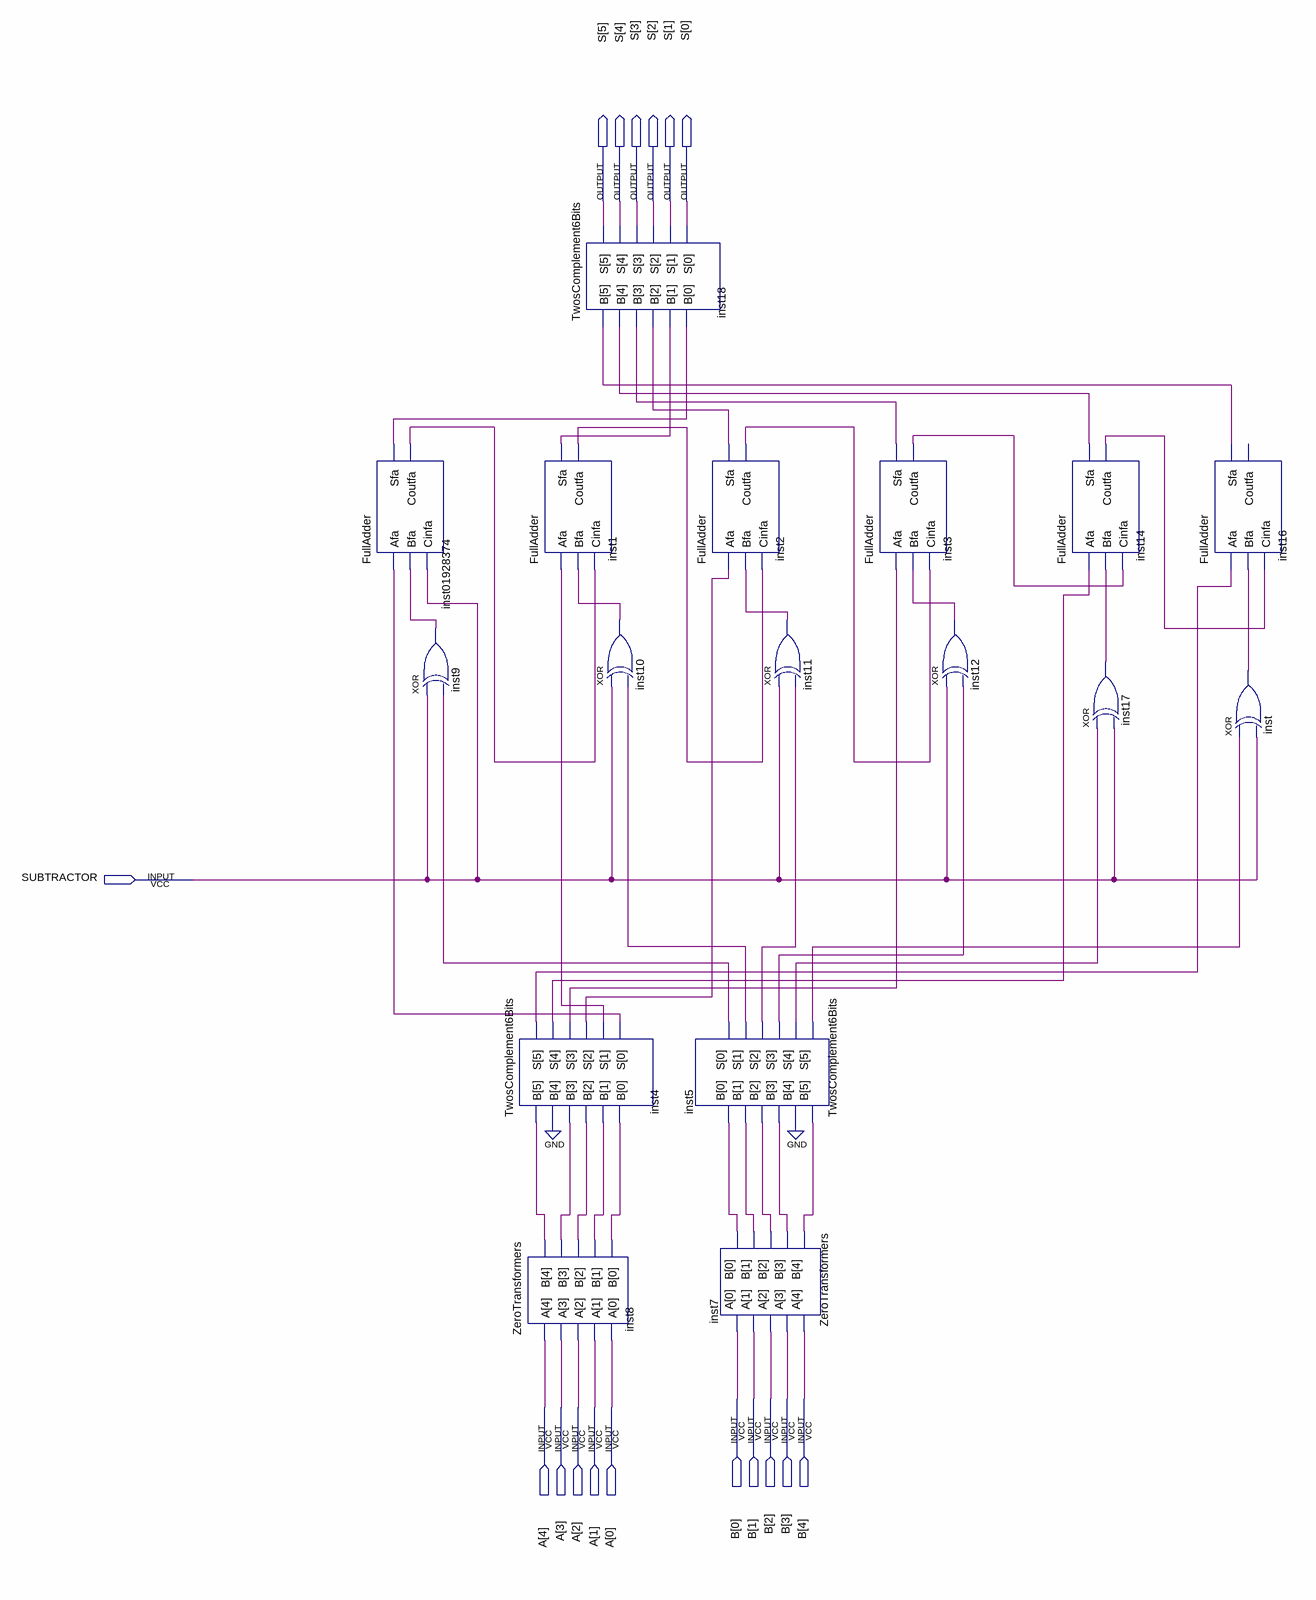
[diagram p0: schematic sheet]
// Quartus schematic SummerSubtractor.bdf as structural Verilog: 17 symbols, 17 pins
module SummerSubtractor (
  input  SUBTRACTOR,
  input  [4:0] B,
  input  [4:0] A,
  output [5:0] S
);

  wire inst1_coutfa, inst1_sfa, inst2_coutfa, inst2_sfa, inst3_coutfa, inst3_sfa, inst4_s, inst4_s_2,
       inst4_s_3, inst4_s_4, inst4_s_5, inst4_s_6, inst5_s, inst5_s_2, inst5_s_3, inst5_s_4, inst5_s_5,
       inst5_s_6, inst7_b, inst7_b_2, inst7_b_3, inst7_b_4, inst7_b_5, inst8_b, inst8_b_2, inst8_b_3,
       inst8_b_4, inst8_b_5, inst9_out, inst10_out, inst11_out, inst12_out, inst14_coutfa, inst14_sfa,
       inst16_sfa, inst17_out, inst01928374_coutfa, inst01928374_sfa, inst_out;

  FullAdder inst01928374 (
    .Afa(inst4_s), .Bfa(inst9_out), .Cinfa(SUBTRACTOR), .Sfa(inst01928374_sfa), .Coutfa(inst01928374_coutfa));
  xor inst9 (inst9_out, SUBTRACTOR, inst5_s);
  FullAdder inst1 (
    .Afa(inst4_s_2), .Bfa(inst10_out), .Cinfa(inst01928374_coutfa), .Sfa(inst1_sfa), .Coutfa(inst1_coutfa));
  TwosComplement6Bits inst4 (
    .B({inst8_b, 1'b0, inst8_b_2, inst8_b_3, inst8_b_4, inst8_b_5}),
    .S({inst4_s_6, inst4_s_5, inst4_s_4, inst4_s_3, inst4_s_2, inst4_s}));
  ZeroTransformers inst8 (.A(A), .B({inst8_b, inst8_b_2, inst8_b_3, inst8_b_4, inst8_b_5}));
  TwosComplement6Bits inst18 (.B({inst16_sfa, inst14_sfa, inst3_sfa, inst2_sfa, inst1_sfa, inst01928374_sfa}), .S(S));
  xor inst10 (inst10_out, SUBTRACTOR, inst5_s_2);
  TwosComplement6Bits inst5 (
    .B({inst7_b_5, 1'b0, inst7_b_4, inst7_b_3, inst7_b_2, inst7_b}),
    .S({inst5_s_6, inst5_s_5, inst5_s_4, inst5_s_3, inst5_s_2, inst5_s}));
  FullAdder inst2 (.Afa(inst4_s_3), .Bfa(inst11_out), .Cinfa(inst1_coutfa), .Sfa(inst2_sfa), .Coutfa(inst2_coutfa));
  ZeroTransformers inst7 (.A(B), .B({inst7_b_5, inst7_b_4, inst7_b_3, inst7_b_2, inst7_b}));
  xor inst11 (inst11_out, SUBTRACTOR, inst5_s_3);
  FullAdder inst3 (.Afa(inst4_s_4), .Bfa(inst12_out), .Cinfa(inst2_coutfa), .Sfa(inst3_sfa), .Coutfa(inst3_coutfa));
  xor inst12 (inst12_out, SUBTRACTOR, inst5_s_4);
  FullAdder inst14 (.Afa(inst4_s_5), .Bfa(inst17_out), .Cinfa(inst3_coutfa), .Sfa(inst14_sfa), .Coutfa(inst14_coutfa));
  xor inst17 (inst17_out, inst5_s_5, SUBTRACTOR);
  FullAdder inst16 (.Afa(inst4_s_6), .Bfa(inst_out), .Cinfa(inst14_coutfa), .Sfa(inst16_sfa));  // open: Coutfa
  xor inst (inst_out, inst5_s_6, SUBTRACTOR);
endmodule
